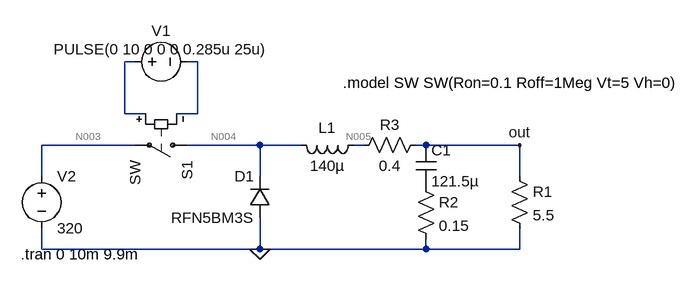
[diagram p0: schematic BuckConverter.asc]
BuckConverter.asc, the LTspice schematic file:
Version 4
SHEET 1 900 680
WIRE 16 -48 0 -48
WIRE 112 -48 96 -48
WIRE 0 32 0 -48
WIRE 32 32 0 32
WIRE 112 32 112 -48
WIRE 112 32 80 32
WIRE 16 80 -128 80
WIRE 208 80 96 80
WIRE 272 80 208 80
WIRE 368 80 352 80
WIRE 464 80 448 80
WIRE 608 80 464 80
WIRE -128 128 -128 80
WIRE 208 128 208 80
WIRE 608 128 608 80
WIRE -128 240 -128 208
WIRE 208 240 208 192
WIRE 208 240 -128 240
WIRE 464 240 464 224
WIRE 464 240 208 240
WIRE 608 240 608 208
WIRE 608 240 464 240
FLAG 208 240 0
FLAG 608 80 out
SYMBOL sw 112 80 R90
SYMATTR InstName S1
SYMBOL voltage 0 -48 R270
WINDOW 0 32 56 VTop 2
WINDOW 3 4 56 VTop 2
WINDOW 123 0 0 Left 0
WINDOW 39 0 0 Left 0
SYMATTR InstName V1
SYMATTR Value PULSE(0 10 0 0 0 0.285u 25u)
SYMBOL voltage -128 112 R0
WINDOW 123 0 0 Left 0
WINDOW 39 0 0 Left 0
SYMATTR InstName V2
SYMATTR Value 320
SYMBOL ind 368 64 R90
WINDOW 0 5 56 VBottom 2
WINDOW 3 32 56 VTop 2
SYMATTR InstName L1
SYMATTR Value 140µ
SYMBOL diode 224 192 R180
WINDOW 0 24 64 Left 2
WINDOW 3 24 0 Left 2
SYMATTR InstName D1
SYMATTR Value RFN5BM3S
SYMBOL cap 448 80 R0
SYMATTR InstName C1
SYMATTR Value 121.5µ
SYMBOL res 592 112 R0
SYMATTR InstName R1
SYMATTR Value 5.5
SYMBOL res 448 128 R0
SYMATTR InstName R2
SYMATTR Value 0.15
SYMBOL res 464 64 R90
WINDOW 0 0 56 VBottom 2
WINDOW 3 32 56 VTop 2
SYMATTR InstName R3
SYMATTR Value 0.4
TEXT 336 -16 Left 2 !.model SW SW(Ron=0.1 Roff=1Meg Vt=5 Vh=0)
TEXT -160 248 Left 2 !.tran 0 10m 9.9m

The netlist it stands for:
* BuckConverter.asc
S1 N004 N003 N001 N002 SW
V1 N001 N002 PULSE(0 10 0 0 0 0.285u 25u)
V2 N003 0 320
L1 N005 N004 140µ
D1 0 N004 RFN5BM3S
C1 out P001 121.5µ
R1 out 0 5.5
R2 P001 0 0.15
R3 out N005 0.4
.model D D
.lib standard.dio
.model SW SW(Ron=0.1 Roff=1Meg Vt=5 Vh=0)
.tran 0 10m 9.9m
.backanno
.end

* Results of the author's LTspice run, read from the files saved beside the schematic
* Operating Point, zero values left out:
*   V(n004) = 1.888 mV
*   V(n003) = 320 V
*   V(n005) = 1.888 mV
*   V(out) = 1.76 mV
*   I(D1) = -101.5 pA
*   I(L1) = -320 µA
*   I(R1) = 320 µA
*   I(R3) = -320 µA
*   I(S1) = 320 µA
*   I(V2) = -320 µA
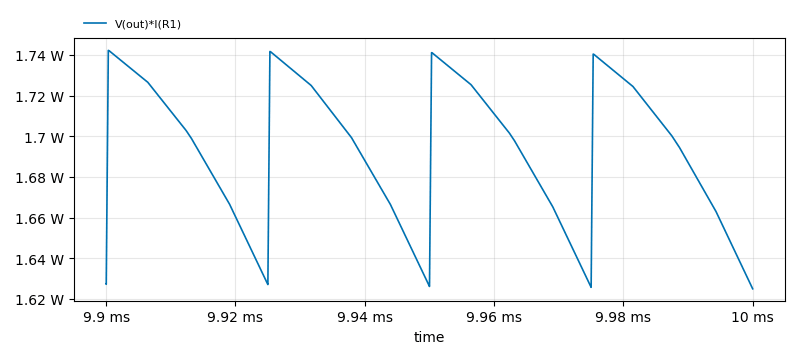
[diagram p1: Transient Analysis of BuckConverter.asc, plotted from the saved traces]
* Transient Analysis, 1 run:
*   V(out)*I(R1): min 1.625 W, max 1.742 W, average 1.694 W, rms 1.694 W, last 1.625 W